# EAGLE schematic pc386ram (EAGLE 7.7.0)
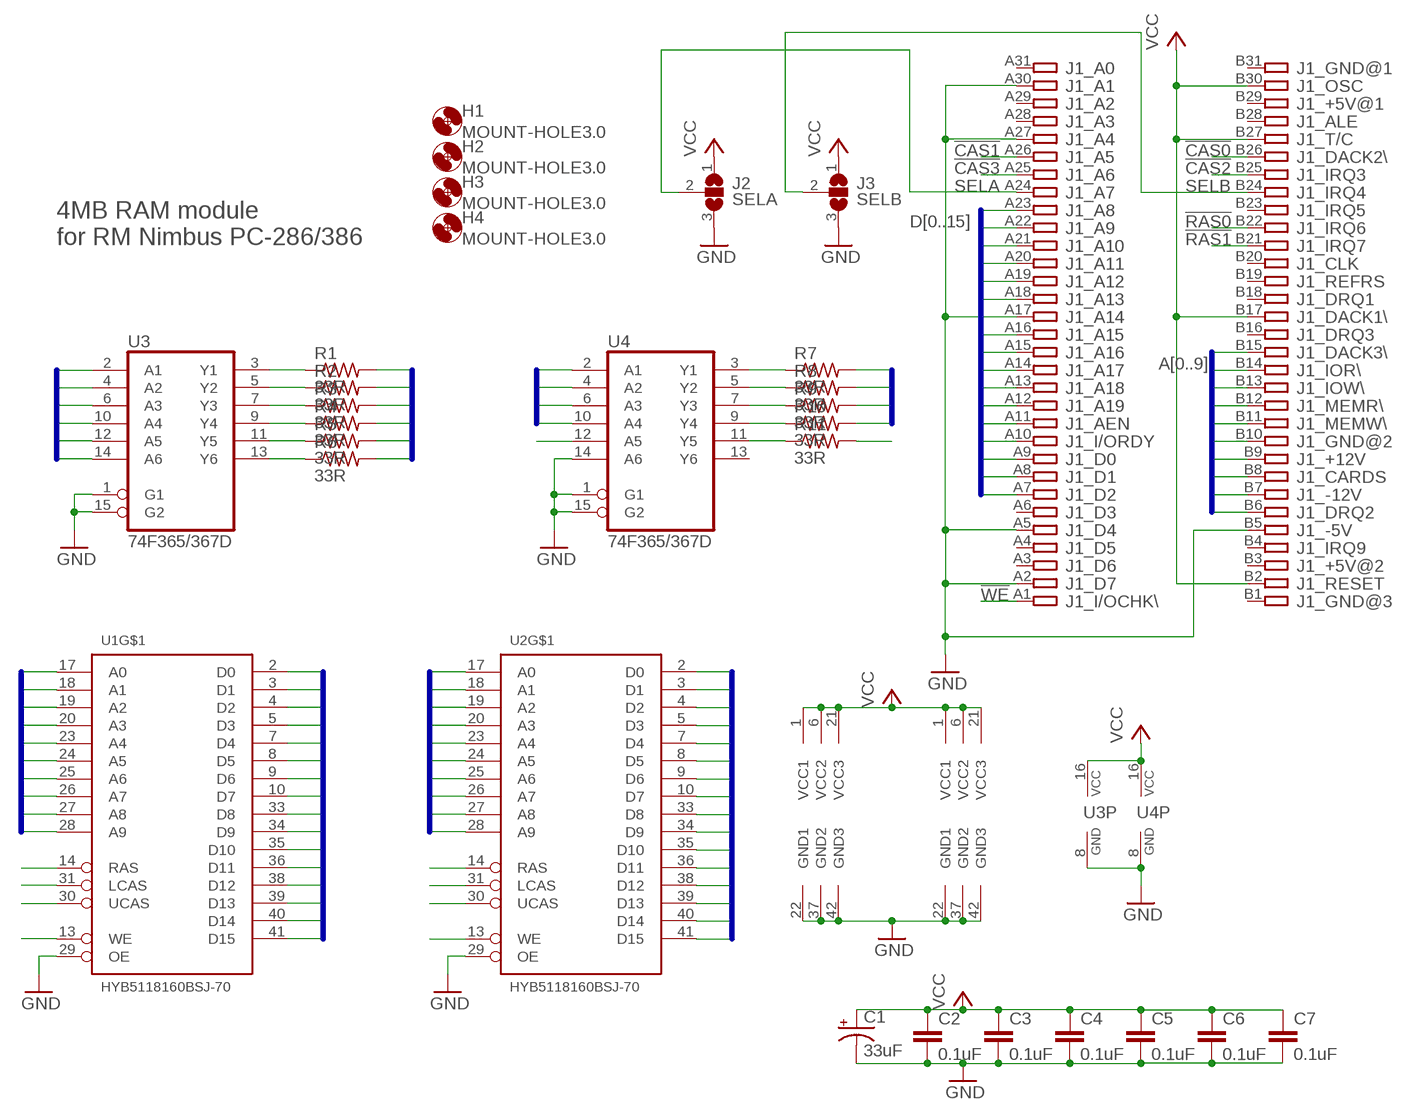
[diagram p0: schematic, sheet 1]

## Parts
C1  33uF  CPOL-USE2.5-7  [E2,5-7]
C2  0.1uF  C-EU050-024X044  [C050-024X044]
C3  0.1uF  C-EU050-024X044  [C050-024X044]
C4  0.1uF  C-EU050-024X044  [C050-024X044]
C5  0.1uF  C-EU050-024X044  [C050-024X044]
C6  0.1uF  C-EU050-024X044  [C050-024X044]
C7  0.1uF  C-EU050-024X044  [C050-024X044]
H1  MOUNT-HOLE3.0  [3,0]
H2  MOUNT-HOLE3.0  [3,0]
H3  MOUNT-HOLE3.0  [3,0]
H4  MOUNT-HOLE3.0  [3,0]
J1  PC-386 RAM slot  IBM8BIT  [IBM8BIT]
J2  SELA  SJ2W  [SJ_2]
J3  SELB  SJ2W  [SJ_2]
R1  33R  R-US_0204/7  [0204/7]
R2  33R  R-US_0204/7  [0204/7]
R3  33R  R-US_0204/7  [0204/7]
R4  33R  R-US_0204/7  [0204/7]
R5  33R  R-US_0204/7  [0204/7]
R6  33R  R-US_0204/7  [0204/7]
R7  33R  R-US_0204/7  [0204/7]
R8  33R  R-US_0204/7  [0204/7]
R9  33R  R-US_0204/7  [0204/7]
R10  33R  R-US_0204/7  [0204/7]
R11  33R  R-US_0204/7  [0204/7]
U1  HYB5118160BSJ-70  [SOJ-42]
U2  HYB5118160BSJ-70  [SOJ-42]
U3  74F365/367D  74HCT365D  [SO16]
U4  74F365/367D  74HCT365D  [SO16]

## Nets
!CAS0: J1.B26 U1.30(UCAS)
!CAS1: J1.A26 U1.31(LCAS)
!CAS2: J1.B25 U2.30(UCAS)
!CAS3: J1.A25 U2.31(LCAS)
!RAS0: J1.B22 U1.14(RAS)
!RAS1: J1.B21 U2.14(RAS)
!WE: J1.A1 U4.12(A5)
A0: J1.B6 U3.2(A1)
A1: J1.B7 U3.4(A2)
A2: J1.B8 U3.6(A3)
A3: J1.B9 U3.10(A4)
A4: J1.B10 U3.12(A5)
A5: J1.B11 U3.14(A6)
A6: J1.B12 U4.2(A1)
A7: J1.B13 U4.4(A2)
A8: J1.B14 U4.6(A3)
A9: J1.B15 U4.10(A4)
B!WE: R11.1 U4.11(Y5)
BA0: R1.1 U3.3(Y1)
BA1: R2.1 U3.5(Y2)
BA2: R3.1 U3.7(Y3)
BA3: R4.1 U3.9(Y4)
BA4: R5.1 U3.11(Y5)
BA5: R6.1 U3.13(Y6)
BA6: R7.1 U4.3(Y1)
BA7: R8.1 U4.5(Y2)
BA8: R9.1 U4.7(Y3)
BA9: R10.1 U4.9(Y4)
D0: J1.A7 U1.2(D0) U2.2(D0)
D1: J1.A8 U1.3(D1) U2.3(D1)
D2: J1.A9 U1.4(D2) U2.4(D2)
D3: J1.A10 U1.5(D3) U2.5(D3)
D4: J1.A11 U1.7(D4) U2.7(D4)
D5: J1.A12 U1.8(D5) U2.8(D5)
D6: J1.A13 U1.9(D6) U2.9(D6)
D7: J1.A14 U1.10(D7) U2.10(D7)
D8: J1.A15 U1.33(D8) U2.33(D8)
D9: J1.A16 U1.34(D9) U2.34(D9)
D10: J1.A18 U1.35(D10) U2.35(D10)
D11: J1.A19 U1.36(D11) U2.36(D11)
D12: J1.A20 U1.38(D12) U2.38(D12)
D13: J1.A21 U1.39(D13) U2.39(D13)
D14: J1.A22 U1.40(D14) U2.40(D14)
D15: J1.A23 U1.41(D15) U2.41(D15)
GND [power]: C1.- C2.2 C3.2 C4.2 C5.2 C6.2 C7.2 J1.A2 J1.A5 J1.A17 J1.A27 J1.A30 J1.B5 J2.3 J3.3 U1.22(GND1) U1.29(OE) U1.37(GND2) U1.42(GND3) U2.22(GND1) U2.29(OE) U2.37(GND2) U2.42(GND3) U3.1(G1) U3.8(GND) U3.15(G2) U4.1(G1) U4.8(GND) U4.14(A6) U4.15(G2)
M!WE: R11.2 U1.13(WE) U2.13(WE)
MA0: R1.2 U1.17(A0) U2.17(A0)
MA1: R2.2 U1.18(A1) U2.18(A1)
MA2: R3.2 U1.19(A2) U2.19(A2)
MA3: R4.2 U1.20(A3) U2.20(A3)
MA4: R5.2 U1.23(A4) U2.23(A4)
MA5: R6.2 U1.24(A5) U2.24(A5)
MA6: R7.2 U1.25(A6) U2.25(A6)
MA7: R8.2 U1.26(A7) U2.26(A7)
MA8: R9.2 U1.27(A8) U2.27(A8)
MA9: R10.2 U1.28(A9) U2.28(A9)
SELA: J1.A24 J2.2
SELB: J1.B24 J3.2
VCC [power]: C1.+ C2.1 C3.1 C4.1 C5.1 C6.1 C7.1 J1.B2 J1.B17 J1.B27 J1.B30 J2.1 J3.1 U1.1(VCC1) U1.6(VCC2) U1.21(VCC3) U2.1(VCC1) U2.6(VCC2) U2.21(VCC3) U3.16(VCC) U4.16(VCC)
Unconnected: J1.A3 J1.A4 J1.A6 J1.A28 J1.A29 J1.A31 J1.B1 J1.B3 J1.B4 J1.B16 J1.B18 J1.B19 J1.B20 J1.B23 J1.B28 J1.B29 J1.B31 U4.13(Y6)

## Buses
D[0..15]
MA[0..9]
A[0..9]

## Notes on the sheet
- 4MB RAM module
  for RM Nimbus PC-286/386

## Library data of the parts
C1 = rcl:CPOL-US: POLARIZED CAPACITOR, American symbol
C2-C7 = rcl:C-EU: CAPACITOR, European symbol
H1-H4 = holes:MOUNT-HOLE: MOUNTING HOLE with drill center marker
J1 = con-pc:IBM8BIT: 8-bit CARD IBM/PC-AT
J2 J3 = jumper:SJ2W: SMD solder JUMPER
R1-R11 = rcl:R-US_: RESISTOR, American symbol
U1 U2 = pc386ram:HYB5118160BSJ: Siemens HYB5118160BSJ-50/-60/-70 1Mx16 DRAM The HYB5118160BSJ is a 16 MBit dynamic RAM organized as 1,048,576 words by 16 bits. The HYB5118160BSJ utilizes a submicron CMOS silicon gate process technology, as well as advanced circuit techniques to provide wide operating margins, both internally and for the system user. Multiplexed address inputs permit the HYB5118160BSJ to be packaged in a standard SOJ-42 400 mil plastic package. These packages provide high system bit densities and are compatible with commonly used automatic testing and insertion equipment. System-oriented features include single +5V (±10%) power supply, direct interfacing with high-performance logic device families such as Schottky TTL.
U3 U4 = 74xx-eu:74*365: Hex BUS DRIVER, 3-state